# EAGLE design magnetometro (EAGLE 9.1.0)
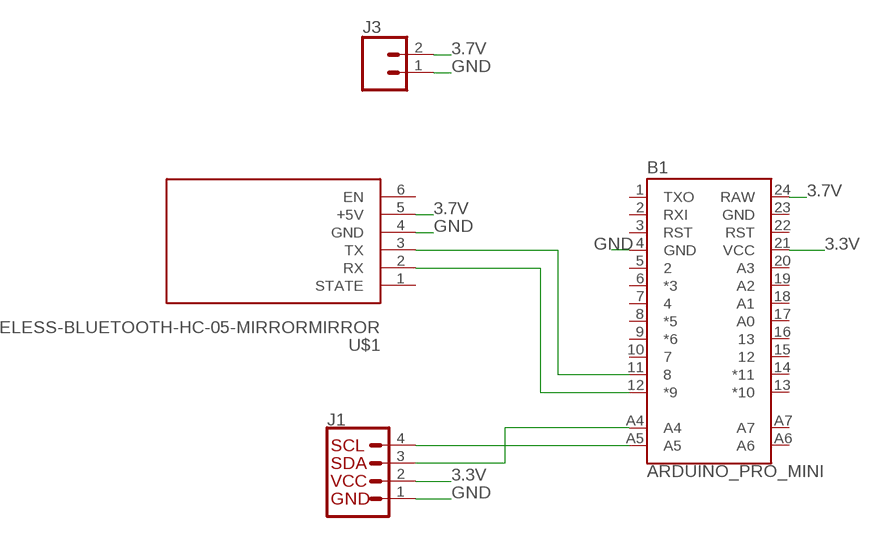
[diagram p0: schematic, sheet 1]

## Parts
B1  ARDUINO_PRO_MINI  [ARDUINO_PRO_MINI]
J1  I2C_STANDARD  [1X04]
J3  CONN_02-JST-2-PTH-NO_SILK  [JST-2-PTH-NS]
U$1  WIRELESS-BLUETOOTH-HC-05-MIRRORMIRROR  [WIRELESS-BLUETOOTH-HC-05-MIRROR]

## Nets
3.3V: B1.21(VCC) J1.2
3.7V: B1.24(RAW) J3.2 U$1.5(+5V)
GND: B1.4(GND) J1.1 J3.1 U$1.4(GND)
N$1: B1.11 U$1.3(TX)
N$2: B1.12(*9) U$1.2(RX)
N$3: B1.A5 J1.4
N$6: B1.A4 J1.3
Unconnected: B1.1(TXO) B1.2(RXI) B1.3(RST) B1.5 B1.6(*3) B1.7 B1.8(*5) B1.9(*6) B1.10 B1.13(*10) B1.14(*11) B1.15 B1.16 B1.17(A0) B1.18(A1) B1.19(A2) B1.20(A3) B1.22(RST) B1.A6 B1.A7 U$1.1(STATE) U$1.6(EN)

## Power pins joined to a net without a drawn wire
GND: B1.23(GND)

## Library data of the parts
B1 = SparkFun-Boards:ARDUINO_PRO_MINI: SparkFun Pro Mini Pro Mini compatible footprint. Dimensions: 0.7 x 1.3" PCB Thickness: 0.8mm SparkFun Products: 3.3V/8MHz <https://www.sparkfun.com/products/11114> 5V/16MHz <https://www.sparkfun.com/products/11113>
J1 = SparkFun-Connectors:I2C_STANDARD: SparkFun I2C Standard Pinout Header SparkFun has standardized on a pinout for all I2C based sensor breakouts. This pinout allows I2C boards to be plugged directly into the headers on Arduino Uno compatible boards, and to be daisy chained easily. Example SparkFun Products: SparkFun Atmospheric Sensor Breakout - BME280 <https://www.sparkfun.com/products/13676> SparkFun Altitude/Pressure Sensor Breakout - MPL3115A2 <https://www.sparkfun.com/products/11084> SparkFun TOF Range Finder Sensor - VL6180 <https://www.sparkfun.com/products/12785>
J3 = SparkFun-Connectors:CONN_02: Multi connection point. Often used as Generic Header-pin footprint for 0.1 inch spaced/style header connections On any of the 0.1 inch spaced packages, you can populate with these: Break Away Headers - Straight <https://www.sparkfun.com/products/116> (PRT-00116) Break Away Male Headers - Right Angle <https://www.sparkfun.com/products/553> (PRT-00553) Female Headers <https://www.sparkfun.com/products/115> (PRT-00115) Break Away Headers - Machine Pin <https://www.sparkfun.com/products/117> (PRT-00117) Break Away Female Headers - Swiss Machine Pin <https://www.sparkfun.com/products/743> (PRT-00743) For SCREWTERMINALS and SPRING TERMINALS visit here: Screw Terimnals on SparkFun.com <https://www.sparkfun.com/search/results?term=Screw+Terminals> (5mm/3.5mm/2.54mm spacing) This device is also useful as a general connection point to wire up your design to another part of your project. Our various solder wires solder well into these plated through hole pads. Hook-Up Wire - Assortment (Stranded, 22 AWG) <https://www.sparkfun.com/products/11375> (PRT-11375) Hook-Up Wire - Assortment (Solid Core, 22 AWG) <https://www.sparkfun.com/products/11367> (PRT-11367) View the entire wire category on our website here <https://www.sparkfun.com/categories/141> Special notes: Molex polarized connector foot print use with: PRT-08233 with associated crimp pins and housings. 2.54_SCREWTERM for use with PRT-10571. 3.5mm Screw Terminal footprints for PRT-08084 5mm Screw Terminal footprints for use with PRT-08432
U$1 = diy-modules:WIRELESS-BLUETOOTH-HC-05-MIRROR: Bluetooth Transceiver Module based on HC-05 board Tutorial is available here: https://arduino-info.wikispaces.com/BlueTooth-HC05-HC06-Modules-How-To Click here to find device on ebay.com <http://www.ebay.com/sch/hc-05+module+rs232>

## Board
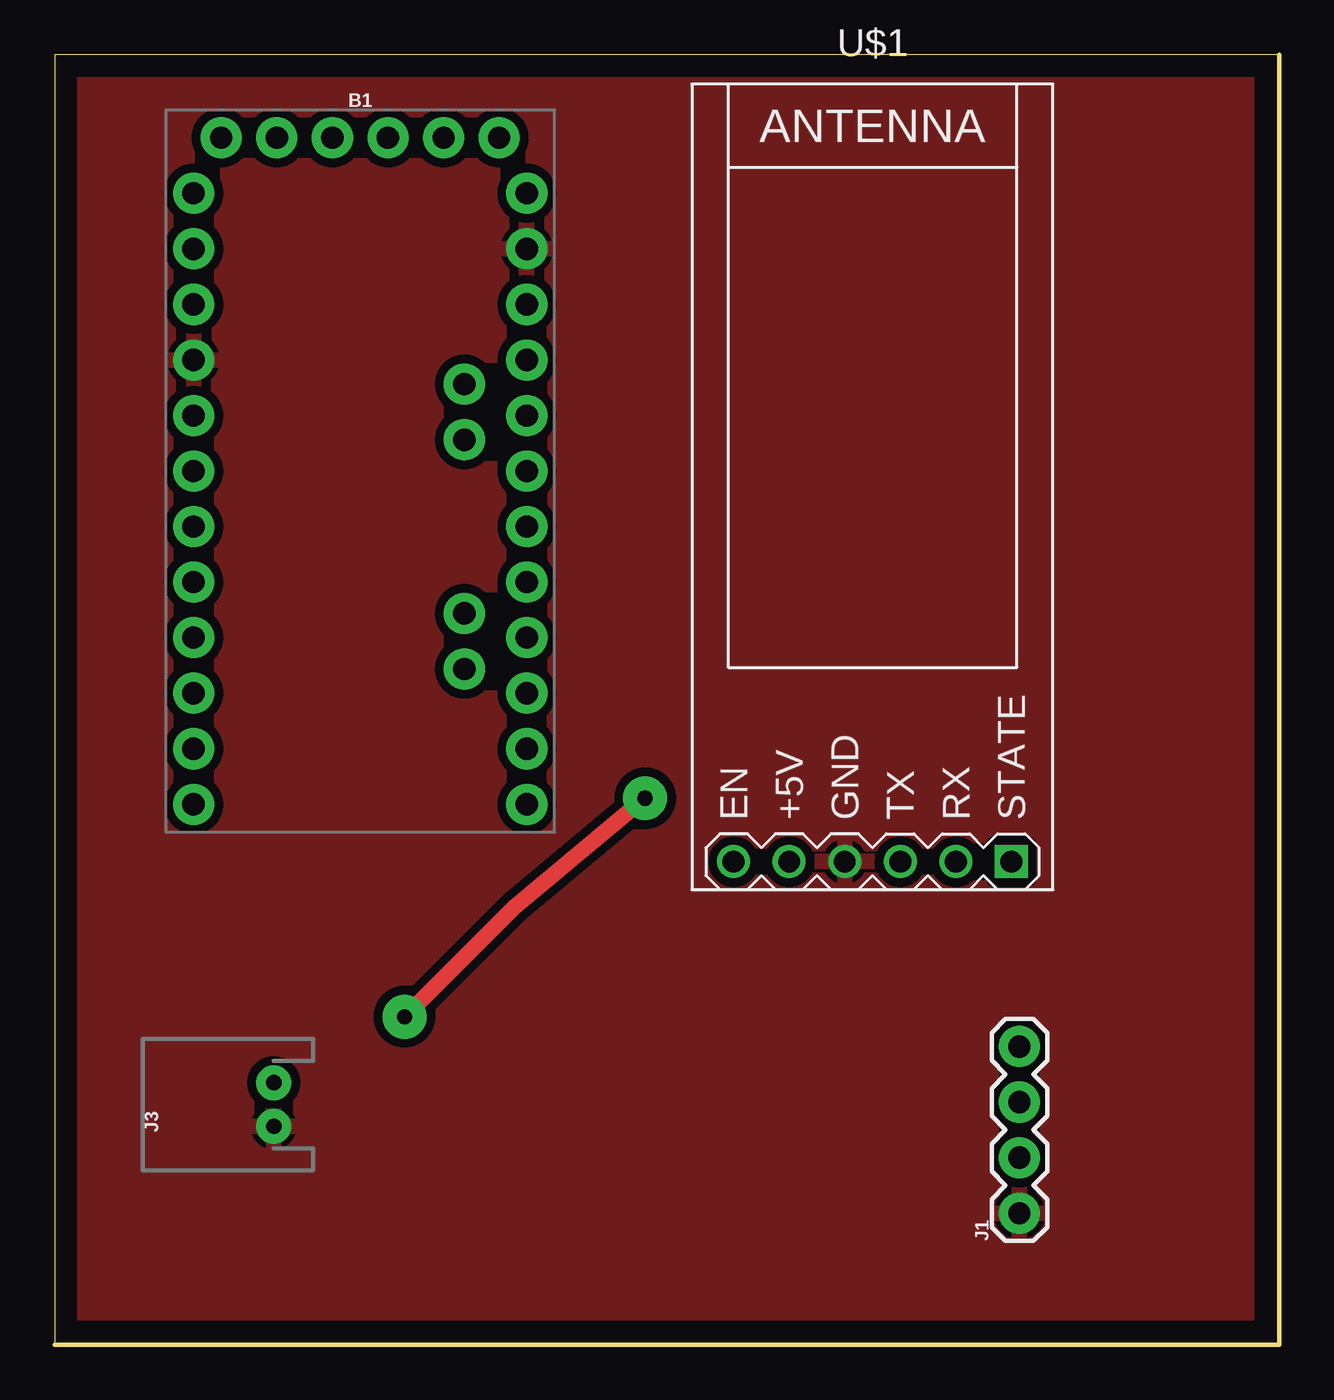
[diagram p1: board, top side]
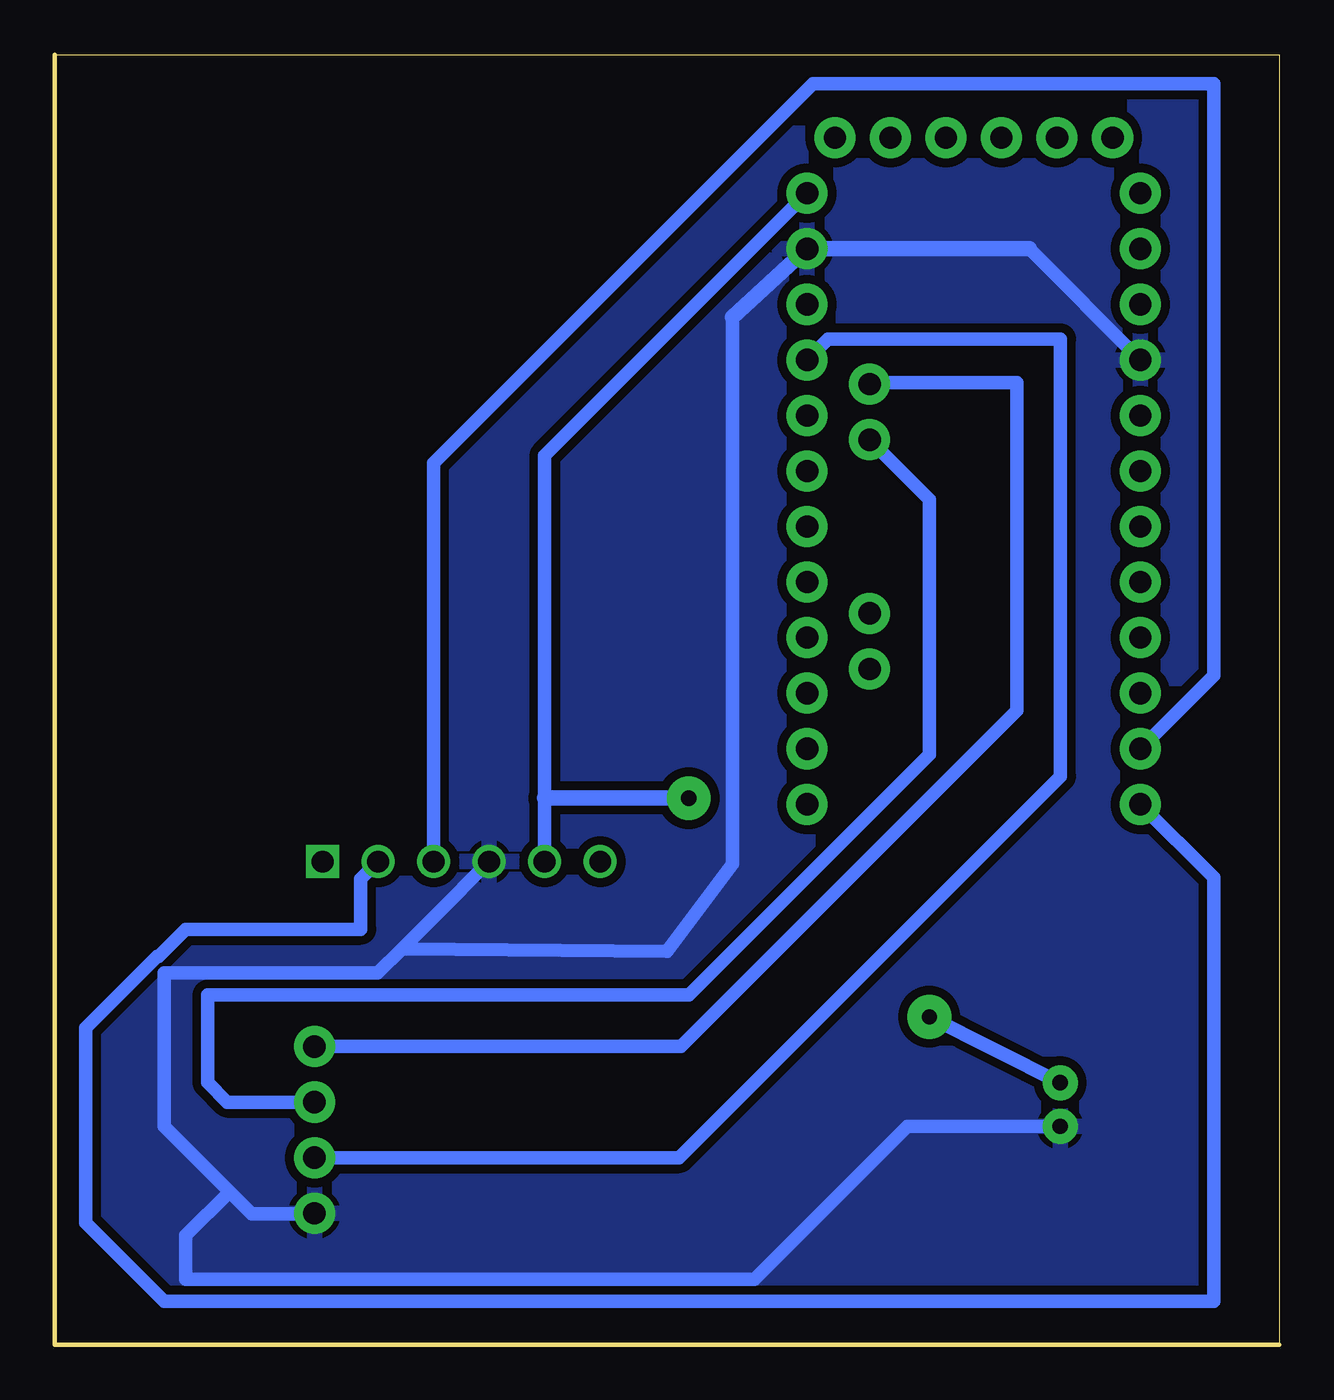
[diagram p2: board, bottom side, seen from below]

Size 56 x 59 mm. Coordinates in mm from the lower left corner, seen from the top.
Outline: 56,59 0,59 0,0 56,0 56,59
Copper layers (1*16): Top 0.035mm / dielectric 1.5mm / Bottom 0.035mm
Design rules "default": minimum track width 6mil, minimum drill 0.35mm, track to track 6mil, track to pad 6mil, pad to pad 6mil, via to via 6mil, smd to smd 6mil, copper to edge 40mil, drill to drill 6mil, minimum pad ring 10mil, minimum via ring 8mil, stop-mask expansion 4mil, vias tented up to drill 0mil, thermal gap 10mil

### Footprints (pad centres in the part's own frame; a part is rotated, then mirrored left to right if it is on the bottom)
ARDUINO_PRO_MINI = drill 1.016 pad 1.88: 1 -7.62,12.7; 2 -7.62,10.16; 3 -7.62,7.62; 4 -7.62,5.08; 5 -7.62,2.54; 6 -7.62,0; 7 -7.62,-2.54; 8 -7.62,-5.08; 9 -7.62,-7.62; 10 -7.62,-10.16; 11 -7.62,-12.7; 12 -7.62,-15.24; 13 7.62,-15.24; 14 7.62,-12.7; 15 7.62,-10.16; 16 7.62,-7.62; 17 7.62,-5.08; 18 7.62,-2.54; 19 7.62,0; 20 7.62,2.54; 21 7.62,5.08; 22 7.62,7.62; 23 7.62,10.16; 24 7.62,12.7; A4 4.763,1.429; A5 4.763,3.969; A6 4.763,-9.049; A7 4.763,-6.509; BLK -6.35,15.24; GND -3.81,15.24; GRN 6.35,15.24; RXI 1.27,15.24; TXO 3.81,15.24; VCC -1.27,15.24
1X04 = drill 1.016 pad 1.88: 1 0,0; 2 2.54,0; 3 5.08,0; 4 7.62,0
JST-2-PTH-NS = drill 0.7 pad 1.6: 1 -1,0; 2 1,0
WIRELESS-BLUETOOTH-HC-05-MIRROR = drill 1 square: 1 6.35,-17.145 | drill 1: 2 3.81,-17.145; 3 1.27,-17.145; 4 -1.27,-17.145; 5 -3.81,-17.145; 6 -6.35,-17.145

### Placement (x,y rotation side)
B1  13.97,39.96 0 top
J1  44.12,6.02 90 top
J3  10.02,10.99 90 top
U$1  37.4,39.24 0 top

### Tracks (layer width: path | path; a pad name or v marks a point on that pad's centre or on a via)
3.3V
  Bottom 0.61: J1.2 27.44,8.56 10,26 10,46 20.63,46 B1.21
3.7V  (via drill 0.7 pad 2)
  Top 0.7: v27,25 21,20 v16,15
  Bottom 0.61: B1.24 33.59,40.66 33.59,25 U$1.5 | J3.2 v16,15
  Bottom 0.7: v27,25 33.59,25
GND
  Bottom 0.61: U$1.4 38.61,19.61 40.11,18.11 | 40.11,18.11 41.23,17 51,17 51,10 48,7 | 48,7 47,6 44.14,6 J1.1 | B1.4 11.43,50.12 | J3.1 17.01,9.99 24,3 50,3 50,5 48,7 | 25,47 25,22 28,18 40.11,18.11
  Bottom 0.7: 11.43,50.12 B1.23 25,47
  pour Bottom (isolate 0.406): 0,59 56,59 56,0 0,0
  pour Top (isolate 0.406): 0,59 56,59 56,0 0,0
N$1
  Bottom 0.61: U$1.3 38.67,40.33 21.32,57.68 3,57.68 3,30.61 B1.11
N$2
  Bottom 0.61: B1.12 3,21.37 3,2 51,2 54.58,5.58 54.58,14.5 51.32,17.76 51.24,17.76 50,19 42,19 42,21.3 U$1.2
N$3
  Bottom 0.61: J1.4 27.36,13.64 12,29 12,44 18.66,44 B1.A5
N$6
  Bottom 0.61: B1.A4 16,38.66 16,27 27,16 49,16 49,12 48.1,11.1 J1.3